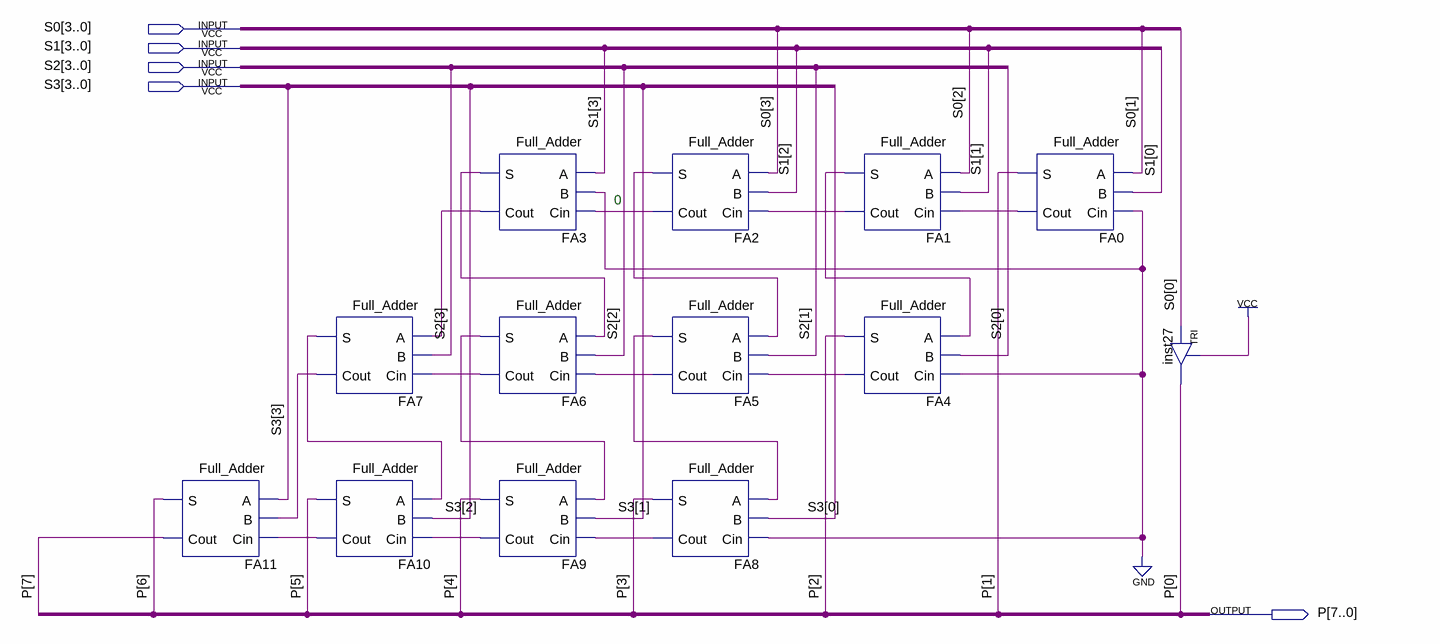
[diagram p0: schematic sheet]
// Quartus schematic Shift_Sum.bdf as structural Verilog: 13 symbols, 5 pins
module Shift_Sum (
  input  [3:0] S0,
  input  [3:0] S1,
  input  [3:0] S2,
  input  [3:0] S3,
  output [7:0] P
);

  wire FA0_cout, FA1_cout, FA1_s, FA2_cout, FA2_s, FA3_cout, FA3_s, FA4_cout, FA5_cout, FA5_s, FA6_cout,
       FA6_s, FA7_cout, FA7_s, FA8_cout, FA9_cout, FA10_cout;

  Full_Adder FA11 (.A(S3[3]), .B(FA7_cout), .Cin(FA10_cout), .S(P[6]), .Cout(P[7]));
  Full_Adder FA7 (.A(FA3_cout), .B(S2[3]), .Cin(FA6_cout), .S(FA7_s), .Cout(FA7_cout));
  Full_Adder FA10 (.A(FA7_s), .B(S3[2]), .Cin(FA9_cout), .S(P[5]), .Cout(FA10_cout));
  Full_Adder FA3 (.A(S1[3]), .B(1'b0), .Cin(FA2_cout), .S(FA3_s), .Cout(FA3_cout));
  Full_Adder FA6 (.A(FA3_s), .B(S2[2]), .Cin(FA5_cout), .S(FA6_s), .Cout(FA6_cout));
  Full_Adder FA9 (.A(FA6_s), .B(S3[1]), .Cin(FA8_cout), .S(P[4]), .Cout(FA9_cout));
  Full_Adder FA2 (.A(S0[3]), .B(S1[2]), .Cin(FA1_cout), .S(FA2_s), .Cout(FA2_cout));
  Full_Adder FA5 (.A(FA2_s), .B(S2[1]), .Cin(FA4_cout), .S(FA5_s), .Cout(FA5_cout));
  Full_Adder FA8 (.A(FA5_s), .B(S3[0]), .Cin(1'b0), .S(P[3]), .Cout(FA8_cout));
  Full_Adder FA1 (.A(S0[2]), .B(S1[1]), .Cin(FA0_cout), .S(FA1_s), .Cout(FA1_cout));
  Full_Adder FA4 (.A(FA1_s), .B(S2[0]), .Cin(1'b0), .S(P[2]), .Cout(FA4_cout));
  Full_Adder FA0 (.A(S0[1]), .B(S1[0]), .Cin(1'b0), .S(P[1]), .Cout(FA0_cout));
  TRI inst27 (.IN(S0[0]), .OE(1'b1), .OUT(P[0]));

  // Notes on the sheet:
  //   0
endmodule
